# Altium project ECG BT&USB 12ch.PrjPcb
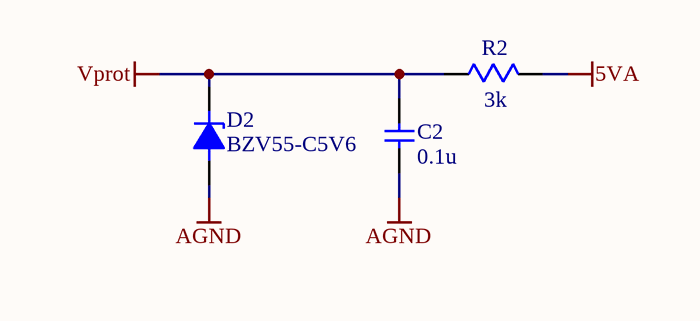
[diagram p0: Input protect power.SchDoc]
5 sheets, 63 parts. Net scope: flat (ports and power ports of the same name join across sheets).
Board file: ECG BT&USB 12ch.PcbDoc
Sheets:
  Input protect power.SchDoc
  RLD and screen.SchDoc
  Analog power.SchDoc
  Processor.SchDoc
  USB.SchDoc

## Sheet Input protect power.SchDoc
size A4

### Parts
C2  0.1u  [SMD/C/0603]
D2  BZV55-C5V6  [SMD/SOD-80C]
R2  3k  [SMD/R/0603]

### Nets
5VA: R2.2
AGND: C2.1 D2.A
Vprot: C2.2 D2.C R2.1

### Library data of the parts
C2 = Capacitor: Value: 0.1u
D2 = Stabilitron: Value: BZV55-C5V6
R2 = Resistor: Value: 3k

## Sheet RLD and screen.SchDoc
size A4
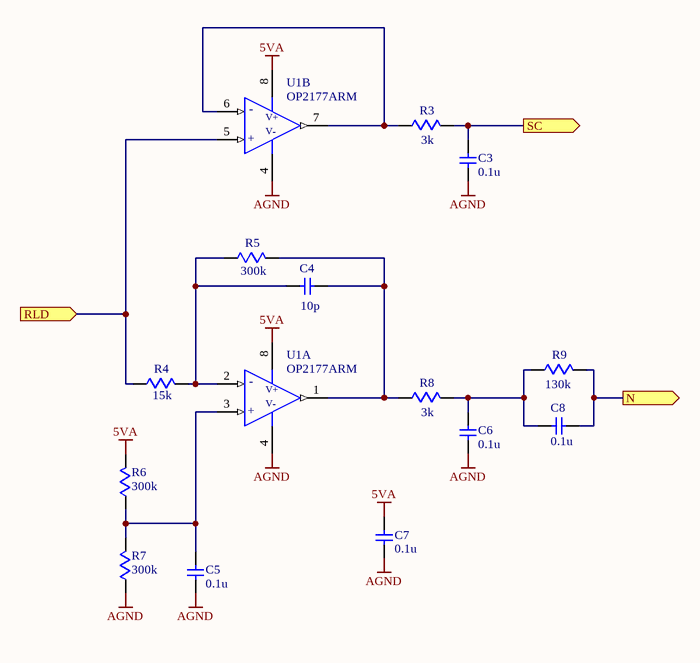
[diagram p1: RLD and screen.SchDoc]

### Parts
C3  0.1u  [SMD/C/0603]
C4  10p  [SMD/C/0603]
C5  0.1u  [SMD/C/0603]
C6  0.1u  [SMD/C/0603]
C7  0.1u  [SMD/C/0603]
C8  0.1u  [SMD/C/0603]
R3  3k  [SMD/R/0603]
R4  15k  [SMD/R/0603]
R5  300k  [SMD/R/0603]
R6  300k  [SMD/R/0603]
R7  300k  [SMD/R/0603]
R8  3k  [SMD/R/0603]
R9  130k  [SMD/R/0603]
U1  OP2177ARM  [SMD/SOP8/0.65MMP/3x3mm/4.9MMWP]  (parts A,B of 2)

### Ports
N (out), RLD (in), SC (out)

### Nets
5VA: C7.2 R6.2 U1.8(V+)
AGND: C3.1 C5.1 C6.1 C7.1 R7.1 U1.4(V-)
NetC3_2: C3.2 R3.2 ; port SC
NetC4_1: C4.1 R5.2 R8.1 U1.1(OUT)
NetC4_2: C4.2 R4.2 R5.1 U1.2(-)
NetC5_2: C5.2 R6.1 R7.2 U1.3(+)
NetC6_2: C6.2 C8.2 R8.2 R9.1
NetC8_1: C8.1 R9.2 ; port N
NetR3_1: R3.1 U1.6(-) U1.7(OUT)
NetR4_1: R4.1 U1.5(+) ; port RLD

### Library data of the parts
C3-C8 = Capacitor
  C3 C5-C8: Value: 0.1u
  C4: Value: 10p
R3-R9 = Resistor
  R3 R8: Value: 3k
  R4: Value: 15k
  R5-R7: Value: 300k
  R9: Value: 130k
U1 = OP2177ARM: Precision Low Noise, Low Input Bias Current Operational Amplifiers; Value: OP2177ARM

## Sheet Analog power.SchDoc
size A4
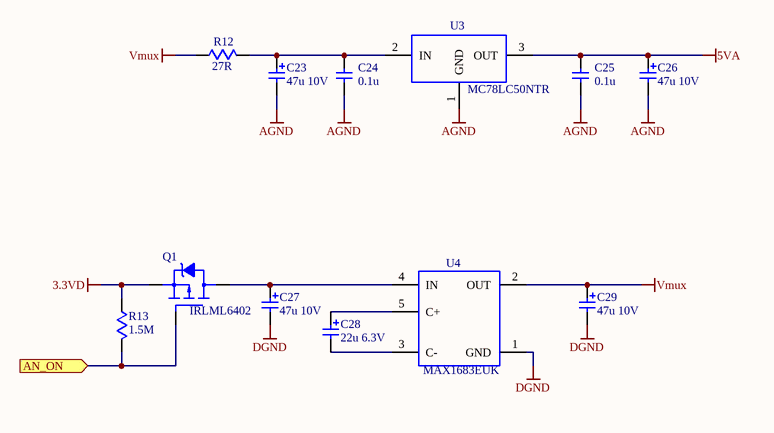
[diagram p2: Analog power.SchDoc]

### Parts
C23  47u 10V  [SMD/C/TAJ-B]
C24  0.1u  [SMD/C/0603]
C25  0.1u  [SMD/C/0603]
C26  47u 10V  [SMD/C/TAJ-B]
C27  47u 10V  [SMD/C/TAJ-B]
C28  22u 6.3V  [SMD/C/TAJ-A]
C29  47u 10V  [SMD/C/TAJ-B]
Q1  IRLML6402  [SMD/SOT23]
R12  27R  [SMD/R/0603]
R13  1.5M  [SMD/R/0603]
U3  MC78LC50NTR  [SMD/SOT23-5]
U4  MAX1683EUK  [SMD/SOT23-5]

### Ports
AN_ON (in)

### Nets
3.3VD: Q1.2(S) R13.1
5VA: C25.2 C26.P U3.3(OUT)
AGND: C23.M C24.1 C25.1 C26.M U3.1(GND)
DGND: C27.M C29.M U4.1(GND)
Vmux: C29.P R12.1 U4.2(OUT)
NetC23_P: C23.P C24.2 R12.2 U3.2(IN)
NetC27_P: C27.P Q1.3(D) U4.4(IN)
NetC28_M: C28.M U4.3(C-)
NetC28_P: C28.P U4.5(C+)
NetQ1_1: Q1.1(G) R13.2 ; port AN_ON

### Library data of the parts
C23 C26-C29 = Capacitor Pol
  C23 C26 C27 C29: Value: 47u 10V
  C28: Value: 22u 6.3V
C24 C25 = Capacitor: Value: 0.1u
Q1 = IRLML6402: P-channel HEXFET Power MOSFET; Value: IRLML6402
R12 R13 = Resistor
  R12: Value: 27R
  R13: Value: 1.5M
U3 = MC78LC50NTR: Micropower Ultra-Low Quiescent Current Voltage Regulator; Value: MC78LC50NTR
U4 = MAX1683EUK: Switched-Capacitor Voltage Doubler; Value: MAX1683EUK

## Sheet Processor.SchDoc
size A4
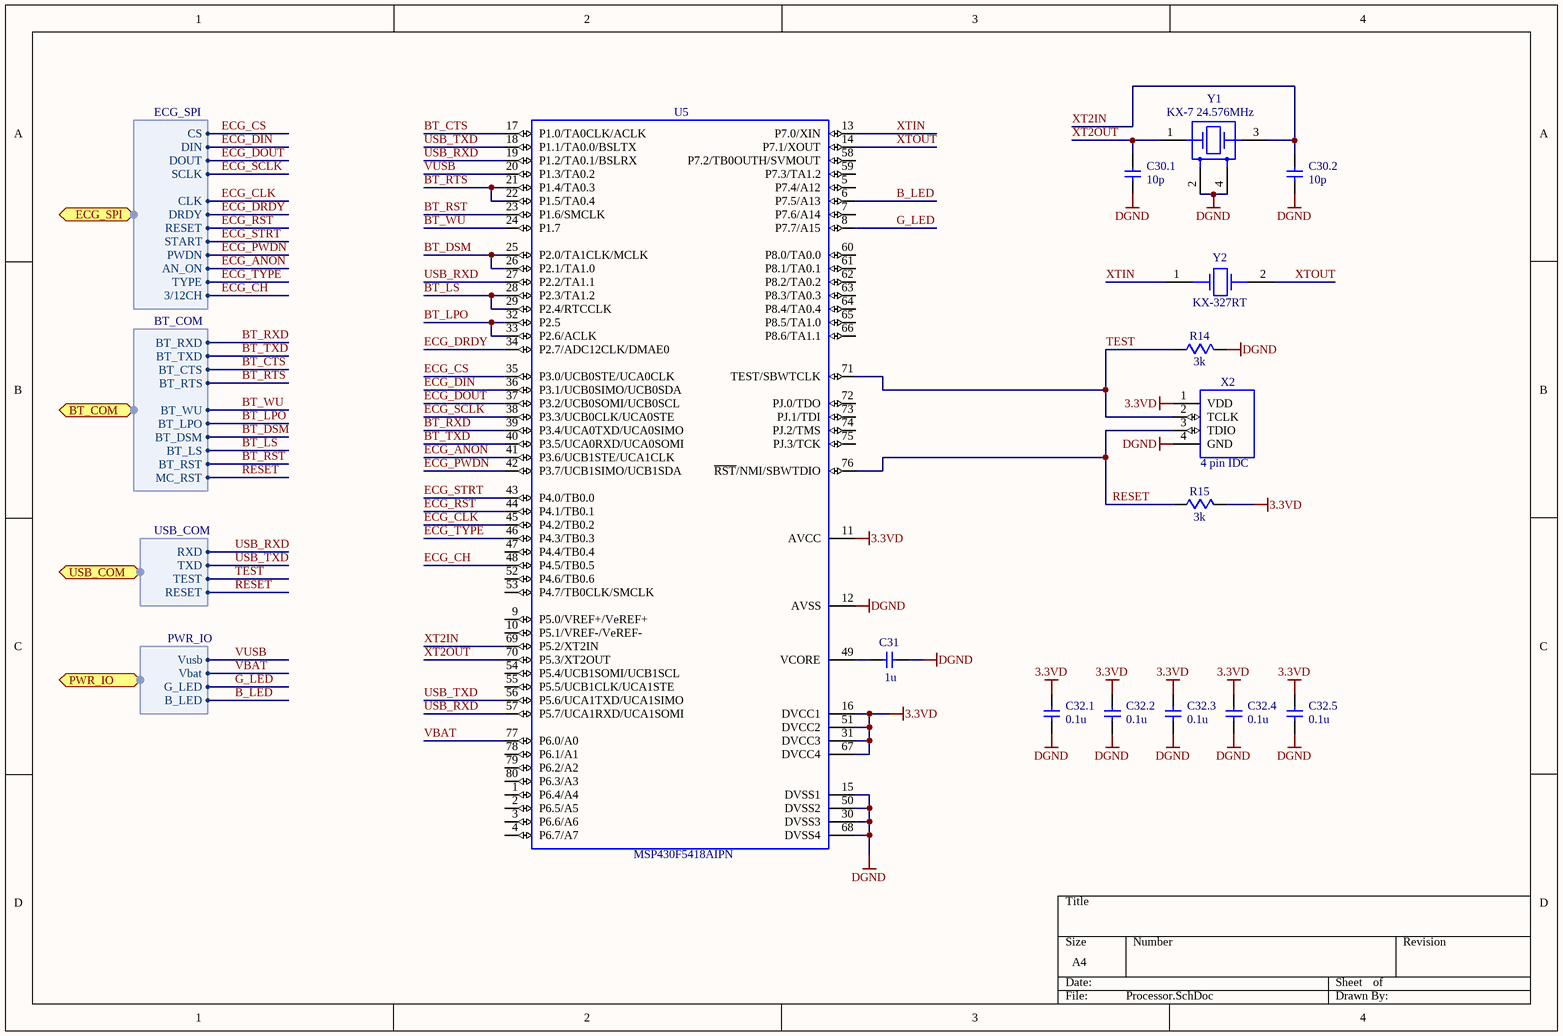
[diagram p3: Processor.SchDoc]

### Parts
C30.1  10p  [SMD/C/0603]
C30.2  10p  [SMD/C/0603]
C31  1u  [SMD/C/0603]
C32.1  0.1u  [SMD/C/0603]
C32.2  0.1u  [SMD/C/0603]
C32.3  0.1u  [SMD/C/0603]
C32.4  0.1u  [SMD/C/0603]
C32.5  0.1u  [SMD/C/0603]
R14  3k  [SMD/R/0603]
R15  3k  [SMD/R/0603]
U5  MSP430F5418AIPN  [SMD/QFP80/0.5MMP/12x12MM/14X14MMWP]
X2  4 pin IDC  [CONNECTOR/IDC/0.05P/1X4]
Y1  KX-7 24.576MHz  [KX-7]
Y2  KX-327RT  [KX–327RT]

### Ports
BT_COM (harness BT_COM), ECG_SPI (harness ECG_SPI), PWR_IO (harness PWR_IO), USB_COM (harness USB_COM)

### Harnesses
ECG_SPI: PWDN, START, DRDY, CLK, DIN, CS, DOUT, SCLK, RESET, 3/12CH, TYPE, AN_ON
BT_COM: BT_RXD, BT_TXD, BT_CTS, BT_RTS, BT_DSM, BT_WU, BT_LS, BT_RST, BT_LPO, MC_RST
USB_COM: RXD, TXD, TEST, RESET
PWR_IO: Vbat, Vusb, G_LED, B_LED

### Nets
3.3VD: C32.1.2 C32.2.2 C32.3.2 C32.4.2 C32.5.2 R15.2 U5.11(AVCC) U5.16(DVCC1) U5.31(DVCC3) U5.51(DVCC2) U5.67(DVCC4) X2.1(VDD)
DGND: C30.1.1 C30.2.1 C31.1 C32.1.1 C32.2.1 C32.3.1 C32.4.1 C32.5.1 R14.2 U5.12(AVSS) U5.15(DVSS1) U5.30(DVSS3) U5.50(DVSS2) U5.68(DVSS4) X2.4(GND) Y1.2 Y1.4
B_LED: U5.6(P7.5/A13) ; port PWR_IO.B_LED
BT_CTS: U5.17(P1.0/TA0CLK/ACLK) ; port BT_COM.BT_CTS
BT_DSM: U5.25(P2.0/TA1CLK/MCLK) U5.26(P2.1/TA1.0) ; port BT_COM.BT_DSM
BT_LPO: U5.32(P2.5) U5.33(P2.6/ACLK) ; port BT_COM.BT_LPO
BT_LS: U5.28(P2.3/TA1.2) U5.29(P2.4/RTCCLK) ; port BT_COM.BT_LS
BT_RST: U5.23(P1.6/SMCLK) ; port BT_COM.BT_RST
BT_RTS: U5.21(P1.4/TA0.3) U5.22(P1.5/TA0.4) ; port BT_COM.BT_RTS
BT_RXD: U5.39(P3.4/UCA0TXD/UCA0SIMO) ; port BT_COM.BT_RXD
BT_TXD: U5.40(P3.5/UCA0RXD/UCA0SOMI) ; port BT_COM.BT_TXD
BT_WU: U5.24(P1.7) ; port BT_COM.BT_WU
ECG_ANON: U5.41(P3.6/UCB1STE/UCA1CLK) ; port ECG_SPI.AN_ON
ECG_CH: U5.48(P4.5/TB0.5) ; port ECG_SPI.3/12CH
ECG_CLK: U5.45(P4.2/TB0.2) ; port ECG_SPI.CLK
ECG_CS: U5.35(P3.0/UCB0STE/UCA0CLK) ; port ECG_SPI.CS
ECG_DIN: U5.36(P3.1/UCB0SIMO/UCB0SDA) ; port ECG_SPI.DIN
ECG_DOUT: U5.37(P3.2/UCB0SOMI/UCB0SCL) ; port ECG_SPI.DOUT
ECG_DRDY: U5.34(P2.7/ADC12CLK/DMAE0) ; port ECG_SPI.DRDY
ECG_PWDN: U5.42(P3.7/UCB1SIMO/UCB1SDA) ; port ECG_SPI.PWDN
ECG_RST: U5.44(P4.1/TB0.1) ; port ECG_SPI.RESET
ECG_SCLK: U5.38(P3.3/UCB0CLK/UCA0STE) ; port ECG_SPI.SCLK
ECG_STRT: U5.43(P4.0/TB0.0) ; port ECG_SPI.START
ECG_TYPE: U5.46(P4.3/TB0.3) ; port ECG_SPI.TYPE
G_LED: U5.8(P7.7/A15) ; port PWR_IO.G_LED
RESET: R15.1 U5.76(~{RST}/NMI/SBWTDIO) X2.3(TDIO) ; port BT_COM.MC_RST, port USB_COM.RESET
TEST: R14.1 U5.71(TEST/SBWTCLK) X2.2(TCLK) ; port USB_COM.TEST
USB_RXD: U5.19(P1.2/TA0.1/BSLRX) U5.27(P2.2/TA1.1) U5.57(P5.7/UCA1RXD/UCA1SOMI) ; port USB_COM.RXD
USB_TXD: U5.18(P1.1/TA0.0/BSLTX) U5.56(P5.6/UCA1TXD/UCA1SIMO) ; port USB_COM.TXD
VBAT: U5.77(P6.0/A0) ; port PWR_IO.Vbat
VUSB: U5.20(P1.3/TA0.2) ; port PWR_IO.Vusb
XT2IN: C30.2.2 U5.69(P5.2/XT2IN) Y1.3
XT2OUT: C30.1.2 U5.70(P5.3/XT2OUT) Y1.1
XTIN: U5.13(P7.0/XIN) Y2.1
XTOUT: U5.14(P7.1/XOUT) Y2.2
NetC31_2: C31.2 U5.49(VCORE)

Not connected (* = marked no-connect by the designer): U5 1(P6.4/A4) 2(P6.5/A5) 3(P6.6/A6) 4(P6.7/A7) 5(P7.4/A12) 7(P7.6/A14) 9(P5.0/VREF+/VeREF+) 10(P5.1/VREF-/VeREF-) 47(P4.4/TB0.4) 52(P4.6/TB0.6) 53(P4.7/TB0CLK/SMCLK) 54(P5.4/UCB1SOMI/UCB1SCL) 55(P5.5/UCB1CLK/UCA1STE) 58(P7.2/TB0OUTH/SVMOUT) 59(P7.3/TA1.2) 60(P8.0/TA0.0) 61(P8.1/TA0.1) 62(P8.2/TA0.2) 63(P8.3/TA0.3) 64(P8.4/TA0.4) 65(P8.5/TA1.0) 66(P8.6/TA1.1) 72(PJ.0/TDO) 73(PJ.1/TDI) 74(PJ.2/TMS) 75(PJ.3/TCK) 78(P6.1/A1) 79(P6.2/A2) 80(P6.3/A3)

### Library data of the parts
C30.1 C30.2 C31 C32.1-C32.5 = Capacitor
  C30.1 C30.2: Value: 10p
  C31: Value: 1u
  C32.1-C32.5: Value: 0.1u
R14 R15 = Resistor: Value: 3k
U5 = MSP430F5418AIPN: Mixed Signal Microcontroller; Value: MSP430F5418AIPN
X2 = MSP430 JTAG SBW: MSP430 JTAG Connector; Value: 4 pin IDC
Y1 = KX-9A: Quartz Crystal; Value: KX-7 24.576MHz
Y2 = KX-327RT: Quartz Crystal; Value: KX-327RT

## Sheet USB.SchDoc
size A4
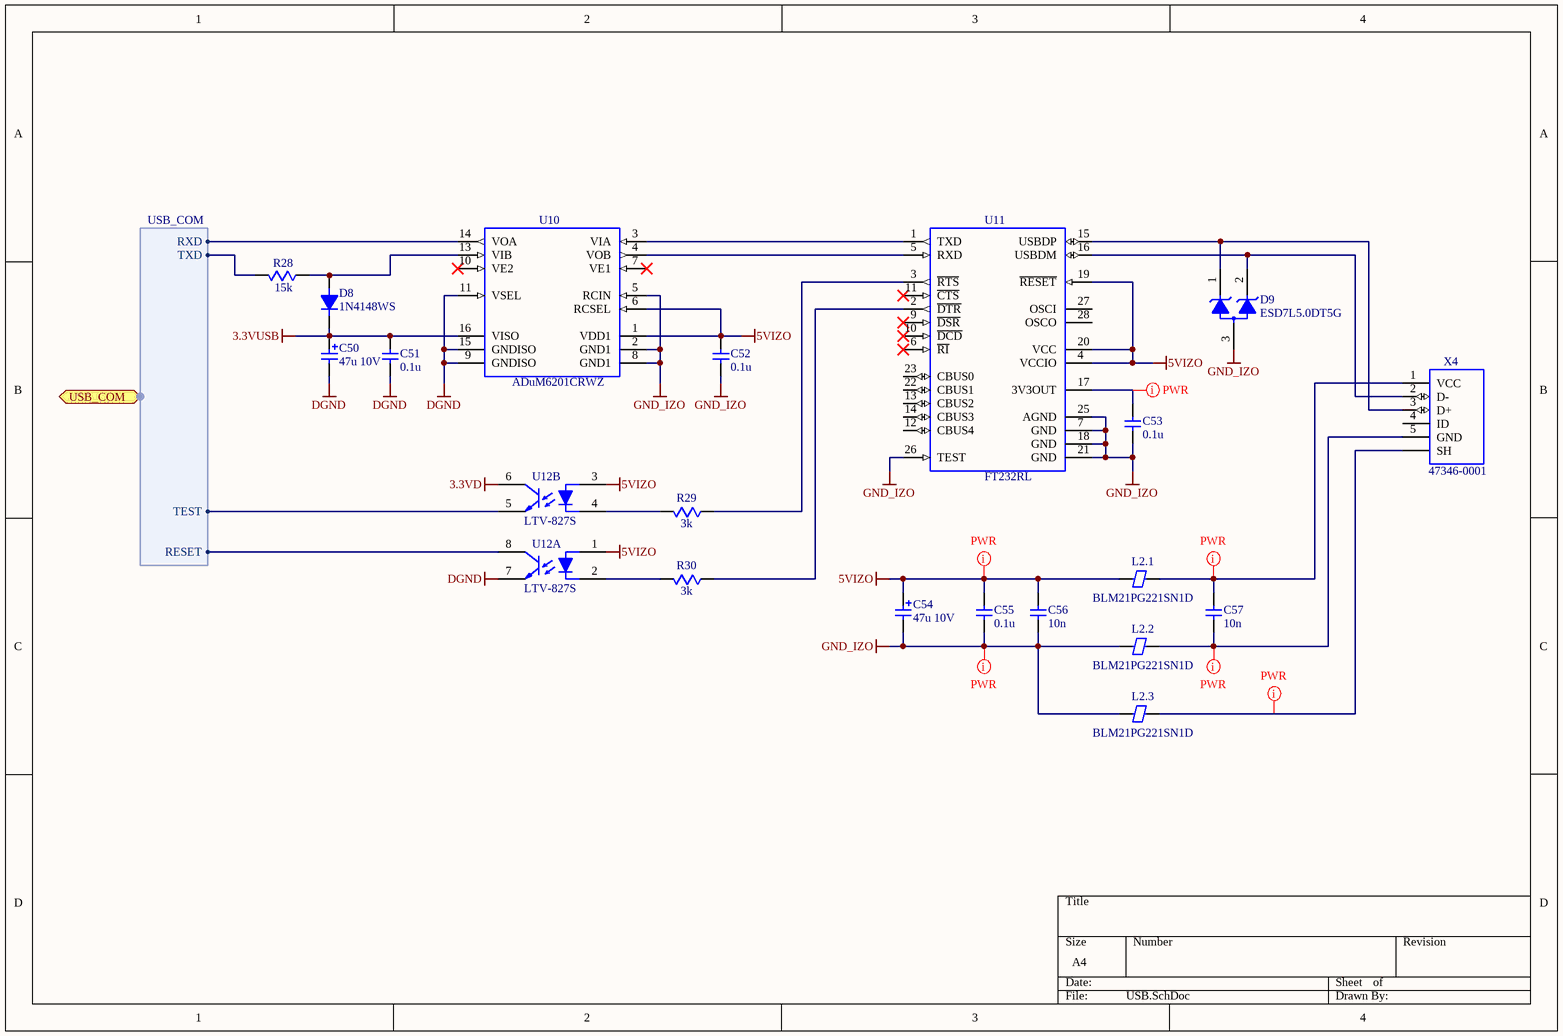
[diagram p4: USB.SchDoc]

### Parts
C50  47u 10V  [SMD/C/TAJ-B]
C51  0.1u  [SMD/C/0603]
C52  0.1u  [SMD/C/0603]
C53  0.1u  [SMD/C/0603]
C54  47u 10V  [SMD/C/TAJ-B]
C55  0.1u  [SMD/C/0603]
C56  10n  [SMD/C/0603]
C57  10n  [SMD/C/0603]
D8  1N4148WS  [SMD/SOD-323]
D9  ESD7L5.0DT5G  [SMD/SOT723]
L2.1  BLM21PG221SN1D  [SMD/C/0805]
L2.2  BLM21PG221SN1D  [SMD/C/0805]
L2.3  BLM21PG221SN1D  [SMD/C/0805]
R28  15k  [SMD/R/0603]
R29  3k  [SMD/R/0603]
R30  3k  [SMD/R/0603]
U10  ADuM6201CRWZ  [SMD/SOIC16/1.27MMP/7.5x10.3mm/10.6MMWP]
U11  FT232RL  [SMD/SOP28/0.65MMP/5.3x10.2mm/7.9MMWP]
U12  LTV-827S  [SMD/DIP8/2.54MMP/9.68x6.5MM/10.16MMWP]  (parts A,B of 2)
X4  47346-0001  [47346-0001]

### Ports
USB_COM (harness USB_COM)

### Harnesses
USB_COM: RXD, TXD, TEST, RESET

### Nets
3.3VD: U12.6(C)
3.3VUSB: C50.P C51.2 D8.C U10.16(VISO)
5VIZO: C52.2 C54.P C55.2 C56.2 L2.1.1 U10.1(VDD1) U10.6(RCSEL) U11.4(VCCIO) U11.19(~{RESET}) U11.20(VCC) U12.1(A) U12.3(A)
DGND: C50.M C51.1 U10.9(GNDISO) U10.11(VSEL) U10.15(GNDISO) U12.7(E)
GND_IZO: C52.1 C53.1 C54.M C55.1 C56.1 D9.3 L2.2.1 L2.3.1 U10.2(GND1) U10.5(RCIN) U10.8(GND1) U11.7(GND) U11.18(GND) U11.21(GND) U11.25(AGND) U11.26(TEST)
RESET: U12.8(C) ; port USB_COM.RESET
TEST: U12.5(E) ; port USB_COM.TEST
USB_RXD: U10.14(VOA) ; port USB_COM.RXD
USB_TXD: R28.2 ; port USB_COM.TXD
NetC53_2: C53.2 U11.17(3V3OUT)
NetC57_1: C57.1 L2.2.2 X4.5(GND)
NetC57_2: C57.2 L2.1.2 X4.1(VCC)
NetD8_A: D8.A R28.1 U10.13(VIB)
NetD9_1: D9.1 U11.15(USBDP) X4.3(D+)
NetD9_2: D9.2 U11.16(USBDM) X4.2(D-)
NetL2.3_2: L2.3.2 X4.CASE(SH)
NetR29_1: R29.1 U11.3(~{RTS})
NetR29_2: R29.2 U12.4(C)
NetR30_1: R30.1 U11.2(~{DTR})
NetR30_2: R30.2 U12.2(C)
NetU10_3: U10.3(VIA) U11.1(TXD)
NetU10_4: U10.4(VOB) U11.5(RXD)

Not connected (* = marked no-connect by the designer): U10 7(VE1)* 10(VE2)*; U11 6(~{RI})* 9(~{DSR})* 10(~{DCD})* 11(~{CTS})* 12(CBUS4) 13(CBUS2) 14(CBUS3) 22(CBUS1) 23(CBUS0) 27(OSCI) 28(OSCO); X4 4(ID)

### Layout directives
net class POWER: 5VIZO, GND_IZO, NetC53_2, NetC57_1, NetC57_2, NetL2.3_2

### Library data of the parts
C50 C54 = Capacitor Pol: Value: 47u 10V
C51-C53 C55-C57 = Capacitor
  C51-C53 C55: Value: 0.1u
  C56 C57: Value: 10n
D8 = Diode: Value: 1N4148WS
D9 = ESD7L5.0DT5G: ESD Protection Diodes with Ultra?Low Capacitance; Value: ESD7L5.0DT5G
R28-R30 = Resistor
  R28: Value: 15k
  R29 R30: Value: 3k
U10 = ADuM6201: Dual-Channel, 5 kV Isolators with Integrated DC-to-DC Converter; Value: ADuM6201CRWZ
U11 = FT232RL: USB to RS232 / RS422 / RS485 Converters; Value: FT232RL
X4 = MicroUSB Connector: USB Connector; Value: 47346-0001
L2.1-L2.3 = BLM21PG221SN1D: Value: BLM21PG221SN1D
U12 = LTV-827S: Value: LTV-827S

## Nets that join several sheets
3.3VD: Analog power (Q1.2 R13.1), Processor (12 pins), USB (U12.6)
5VA: Input protect power (R2.2), RLD and screen (C7.2 R6.2 U1.8), Analog power (C25.2 C26.P U3.3)
AGND: Input protect power (C2.1 D2.A), RLD and screen (6 pins), Analog power (5 pins)
DGND: Analog power (C27.M C29.M U4.1), Processor (17 pins), USB (6 pins)
RESET: Processor (R15.1 U5.76 X2.3), USB (U12.8)
TEST: Processor (R14.1 U5.71 X2.2), USB (U12.5)
USB_RXD: Processor (U5.19 U5.27 U5.57), USB (U10.14)
USB_TXD: Processor (U5.18 U5.56), USB (R28.2)